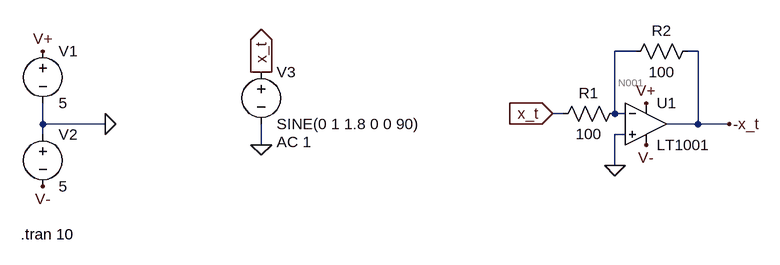
[diagram p0: schematic Draft2.asc]
Draft2.asc, the LTspice schematic file:
Version 4
SHEET 1 880 680
WIRE 528 128 496 128
WIRE 624 128 608 128
WIRE 416 224 400 224
WIRE 496 224 496 128
WIRE 512 224 496 224
WIRE -384 240 -384 208
WIRE -288 240 -384 240
WIRE 624 240 624 128
WIRE 624 240 576 240
WIRE 672 240 624 240
WIRE -384 256 -384 240
WIRE 512 256 496 256
WIRE -48 272 -48 240
WIRE 496 304 496 256
FLAG -384 128 V+
FLAG -384 336 V-
FLAG -288 240 0
FLAG -48 160 x_t
IOPIN -48 160 Out
FLAG -48 272 0
FLAG 400 224 x_t
IOPIN 400 224 In
FLAG 496 304 0
FLAG 672 240 -x_t
FLAG 544 208 V+
FLAG 544 272 V-
SYMBOL voltage -384 112 R0
WINDOW 123 0 0 Left 0
WINDOW 39 0 0 Left 0
SYMATTR InstName V1
SYMATTR Value 5
SYMBOL voltage -384 240 R0
WINDOW 123 0 0 Left 0
WINDOW 39 0 0 Left 0
SYMATTR InstName V2
SYMATTR Value 5
SYMBOL voltage -48 144 R0
WINDOW 123 24 124 Left 2
WINDOW 39 0 0 Left 0
SYMATTR InstName V3
SYMATTR Value SINE(0 1 1.8 0 0 90)
SYMATTR Value2 AC 1
SYMBOL OpAmps\\LT1001 544 176 R0
SYMATTR InstName U1
SYMBOL res 512 208 R90
WINDOW 0 0 56 VBottom 2
WINDOW 3 32 56 VTop 2
SYMATTR InstName R1
SYMATTR Value 100
SYMBOL res 624 112 R90
WINDOW 0 0 56 VBottom 2
WINDOW 3 32 56 VTop 2
SYMATTR InstName R2
SYMATTR Value 100
TEXT -418 410 Left 2 !.tran 10

The netlist it stands for:
* Draft2.asc
V1 V+ 0 5
V2 0 V- 5
V3 x_t 0 SINE(0 1 1.8 0 0 90) AC 1
XU1 0 N001 V+ V- -x_t LT1001  ; pins In+ In- V+ V- OUT
R1 N001 x_t 100
R2 -x_t N001 100
.tran 10
.lib LTC.lib
.backanno
.end

* Results of the author's LTspice run, read from the files saved beside the schematic
* Operating Point, zero values left out:
*   V(v+) = 5 V
*   V(v-) = -5 V
*   V(x_t) = 1 V
*   V(n001) = 1.788 µV
*   V(-x_t) = -1 V
*   I(R2) = -10 mA
*   I(R1) = -10 mA
*   I(V3) = -10 mA
*   I(V2) = -10 mA
*   I(V1) = -654.2 pA
*   Ix(u1:3) = 648.2 pA
*   Ix(u1:4) = -10 mA
*   Ix(u1:5) = 10 mA
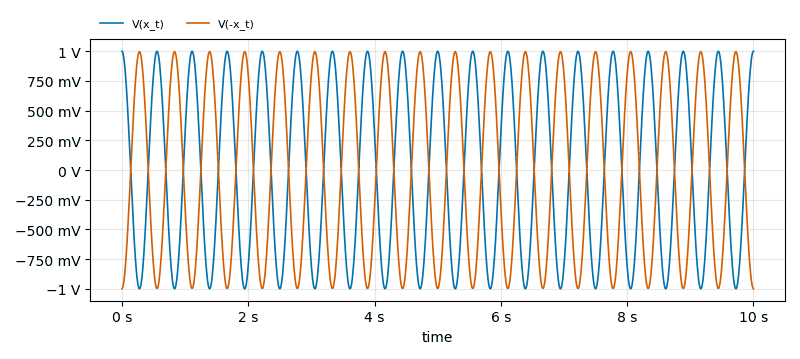
[diagram p1: Transient Analysis of Draft2.asc, plotted from the saved traces]
* Transient Analysis, 1 run:
*   V(x_t): min -999.5 mV, max 1 V, average 1.03 µV, rms 707.1 mV, last 1 V
*   V(-x_t): min -1 V, max 996.5 mV, average -16.46 µV, rms 705 mV, last -1 V